# Altium schematic sheet mcu_headers.SchDoc
size A4
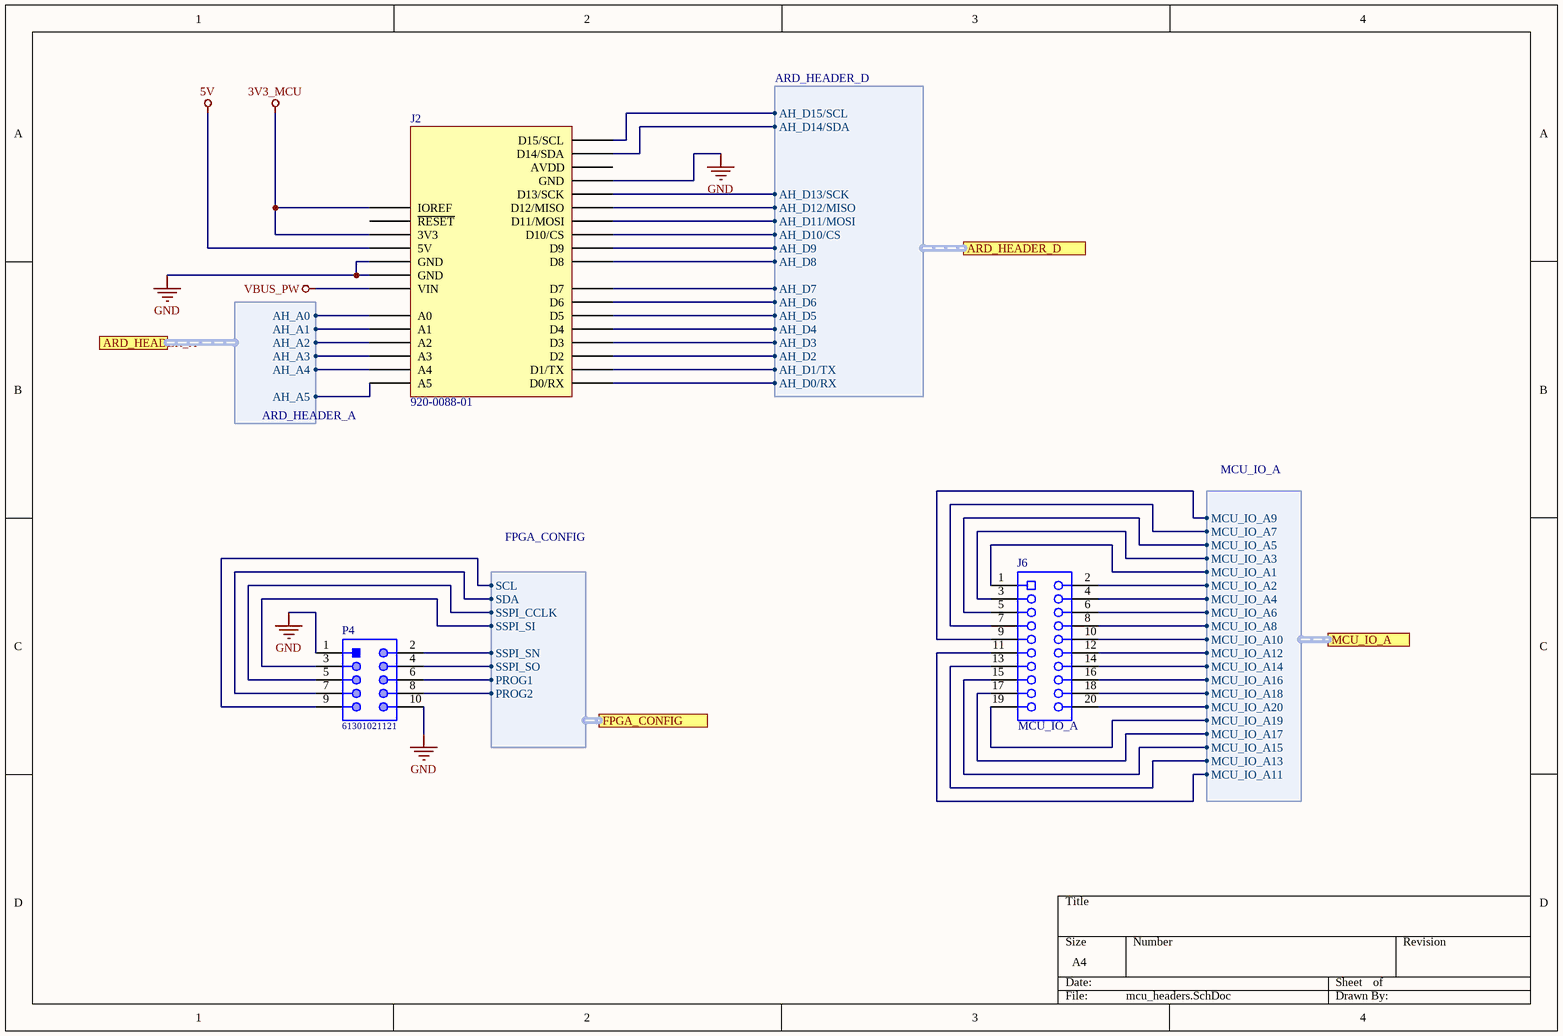
[diagram p0: mcu_headers.SchDoc]

## Parts
J2  920-0088-01  [SCHMARTBOARD - 920-0088-01]
J6  MCU_IO_A  [SLIN-PPPC102LFBN-RC_V]
P4  61301021121  [61301021121]

## Ports
ARD_HEADER_A (harness ARD_HEADER_A), ARD_HEADER_D (harness ARD_HEADER_D), FPGA_CONFIG (harness FPGA_CONFIG), MCU_IO_A (harness MCU_IO_A)

## Harnesses
ARD_HEADER_D: AH_D15/SCL, AH_D14/SDA, AH_D13/SCK, AH_D12/MISO, AH_D11/MOSI, AH_D10/CS, AH_D9, AH_D8, AH_D7, AH_D5, AH_D4, AH_D3, AH_D2, AH_D1/TX, AH_D0/RX, AH_D6
MCU_IO_A: MCU_IO_A9, MCU_IO_A7, MCU_IO_A5, MCU_IO_A3, MCU_IO_A1, MCU_IO_A2, MCU_IO_A4, MCU_IO_A6, MCU_IO_A8, MCU_IO_A10, MCU_IO_A12, MCU_IO_A14, MCU_IO_A16, MCU_IO_A18, MCU_IO_A20, MCU_IO_A19, MCU_IO_A17, MCU_IO_A15, MCU_IO_A13, MCU_IO_A11
FPGA_CONFIG: SSPI_SN, SSPI_SO, PROG1, PROG2, SSPI_SI, SSPI_CCLK, SDA, SCL
ARD_HEADER_A: AH_A0, AH_A1, AH_A2, AH_A3, AH_A4, AH_A5

## Nets
3V3_MCU: J2.2(IOREF) J2.4(3V3)
5V: J2.5(5V)
GND: J2.6(GND) J2.7(GND) J2.29(GND) P4.1 P4.10
VBUS_PW: J2.8(VIN)
NetJ2_9: J2.9(A0) ; port ARD_HEADER_A.AH_A0
NetJ2_10: J2.10(A1) ; port ARD_HEADER_A.AH_A1
NetJ2_11: J2.11(A2) ; port ARD_HEADER_A.AH_A2
NetJ2_12: J2.12(A3) ; port ARD_HEADER_A.AH_A3
NetJ2_13: J2.13(A4) ; port ARD_HEADER_A.AH_A4
NetJ2_14: J2.14(A5) ; port ARD_HEADER_A.AH_A5
NetJ2_15: J2.15(D0/RX) ; port ARD_HEADER_D.AH_D0/RX
NetJ2_16: J2.16(D1/TX) ; port ARD_HEADER_D.AH_D1/TX
NetJ2_17: J2.17(D2) ; port ARD_HEADER_D.AH_D2
NetJ2_18: J2.18(D3) ; port ARD_HEADER_D.AH_D3
NetJ2_19: J2.19(D4) ; port ARD_HEADER_D.AH_D4
NetJ2_20: J2.20(D5) ; port ARD_HEADER_D.AH_D5
NetJ2_21: J2.21(D6) ; port ARD_HEADER_D.AH_D6
NetJ2_22: J2.22(D7) ; port ARD_HEADER_D.AH_D7
NetJ2_23: J2.23(D8) ; port ARD_HEADER_D.AH_D8
NetJ2_24: J2.24(D9) ; port ARD_HEADER_D.AH_D9
NetJ2_25: J2.25(D10/CS) ; port ARD_HEADER_D.AH_D10/CS
NetJ2_26: J2.26(D11/MOSI) ; port ARD_HEADER_D.AH_D11/MOSI
NetJ2_27: J2.27(D12/MISO) ; port ARD_HEADER_D.AH_D12/MISO
NetJ2_28: J2.28(D13/SCK) ; port ARD_HEADER_D.AH_D13/SCK
NetJ2_31: J2.31(D14/SDA) ; port ARD_HEADER_D.AH_D14/SDA
NetJ2_32: J2.32(D15/SCL) ; port ARD_HEADER_D.AH_D15/SCL
NetJ6_1: J6.1 ; port MCU_IO_A.MCU_IO_A1
NetJ6_2: J6.2 ; port MCU_IO_A.MCU_IO_A2
NetJ6_3: J6.3 ; port MCU_IO_A.MCU_IO_A3
NetJ6_4: J6.4 ; port MCU_IO_A.MCU_IO_A4
NetJ6_5: J6.5 ; port MCU_IO_A.MCU_IO_A5
NetJ6_6: J6.6 ; port MCU_IO_A.MCU_IO_A6
NetJ6_7: J6.7 ; port MCU_IO_A.MCU_IO_A7
NetJ6_8: J6.8 ; port MCU_IO_A.MCU_IO_A8
NetJ6_9: J6.9 ; port MCU_IO_A.MCU_IO_A9
NetJ6_10: J6.10 ; port MCU_IO_A.MCU_IO_A10
NetJ6_11: J6.11 ; port MCU_IO_A.MCU_IO_A11
NetJ6_12: J6.12 ; port MCU_IO_A.MCU_IO_A12
NetJ6_13: J6.13 ; port MCU_IO_A.MCU_IO_A13
NetJ6_14: J6.14 ; port MCU_IO_A.MCU_IO_A14
NetJ6_15: J6.15 ; port MCU_IO_A.MCU_IO_A15
NetJ6_16: J6.16 ; port MCU_IO_A.MCU_IO_A16
NetJ6_17: J6.17 ; port MCU_IO_A.MCU_IO_A17
NetJ6_18: J6.18 ; port MCU_IO_A.MCU_IO_A18
NetJ6_19: J6.19 ; port MCU_IO_A.MCU_IO_A19
NetJ6_20: J6.20 ; port MCU_IO_A.MCU_IO_A20
NetP4_2: P4.2 ; port FPGA_CONFIG.SSPI_SN
NetP4_3: P4.3 ; port FPGA_CONFIG.SSPI_SI
NetP4_4: P4.4 ; port FPGA_CONFIG.SSPI_SO
NetP4_5: P4.5 ; port FPGA_CONFIG.SSPI_CCLK
NetP4_6: P4.6 ; port FPGA_CONFIG.PROG1
NetP4_7: P4.7 ; port FPGA_CONFIG.SDA
NetP4_8: P4.8 ; port FPGA_CONFIG.PROG2
NetP4_9: P4.9 ; port FPGA_CONFIG.SCL

Not connected (* = marked no-connect by the designer): J2 3(~{RESET}) 30(AVDD)

## Library data of the parts
J2 = 920-0088-01: CONN HDR 8/10P 0.1 GOLD PCB 6PC; Manufacturer: Schmartboard, Inc.; Connector Type: Header; Contact Length - Post: 0.413" (10.50mm); Number of Positions: 6, 8, 10; Number of Positions Loaded: All; Pitch - Mating: 0.100" (2.54mm); Style: Board to Board; Part Number: 920-0088-01; ComponentLink1Description: Datasheet; ComponentLink1URL: http://schmartboard.com/content/Brochures/920-0088-01.pdf; ComponentLink2Description: DigiKey Link; ComponentLink2URL: http://digikey.com/product-detail/en/schmartboard-inc/920-0088-01/1988-1036-ND/9559319; Contact Finish - Mating: Gold; Contact Finish - Post: Gold; Contact Type: Female Socket; Fastening Type: Push-Pull; Insulation Color: Black; Insulation Height: 0.335" (8.51mm); LastUpdated: 31.01.2020 20:49:58; Lifecycle Status: Active; Minimum Order: 1; Mounting Type: Through Hole; Number of Rows: 1; Packaging: Bulk; Part Status: Active; Price: 5.00; Series: -; Supplier 1: DigiKey; Supplier Part Number 1: 1988-1036-ND; Termination: Solder
J6 = CMP-1770-00003-1: Female Header, Pitch 2.54 mm, 2 x 10 Position, Height 8.75 mm, Tail Length 3.2 mm, -40 to 105 degC, RoHS, Bulk; Max Supply Voltage: 16 V; Frequency: 100 KHz; Case\Package: SOIC; Min Supply Voltage: 4.5 V; Max Ouput Current: -200 mA; Package Quantity: 2500; ComponentLink1Description: Datasheet; Min Operating Temperature: 0 degC; Pins: 8; Weight: 0.002561 oz; Radiation Hardening: No; Mount: Surface Mount; Width: 3.91 mm; RoHSCompliant: true; ComponentLink1URL: http://datasheet.octopart.com/PPPC102LFBN-RC-Sullins-datasheet-8327184.pdf; DatasheetVersion: Rev. D, 10/2007; Max Operating Temperature: 70 degC; Height: 1.58 mm; Length: 4.9 mm; PackageReference: PPPC102LFBN-RC; Packaging: Tape and Reel; REACH SVHC: No SVHC; PackageDescription: Female Header, Pitch 2.54 mm, 2 x 10 Position, Height 8.75 mm, Tail Length 3.2 mm
P4 = CMP-1502-01084-1: THT Vertical Pin Header WR-PHD, Pitch 2.54 mm, Dual Row, 10 pins; Manufacturer: Wurth Elektronik; Working Voltage: 250VAC; Pitch: 2.54mm; Contact Resistance: 20mOhm; Gender: Male; Rated Current: 3A; Withstanding Voltage: 500VAC; Pin Number: 10; Operating Temperature: -40to105degC; Mounting Technology: THT; Publisher: WurthElektronik; Manufacturer URL: http://www.we-online.de; Part Number: 61301021121; Row Number: Dual; Packaging: Bag; Orientation: Vertical; Package Reference: 61301021121; Datasheet URL: https://katalog.we-online.de/em/datasheet/6130xx21121.pdf